# EAGLE design MotorBoard (EAGLE 5.11)
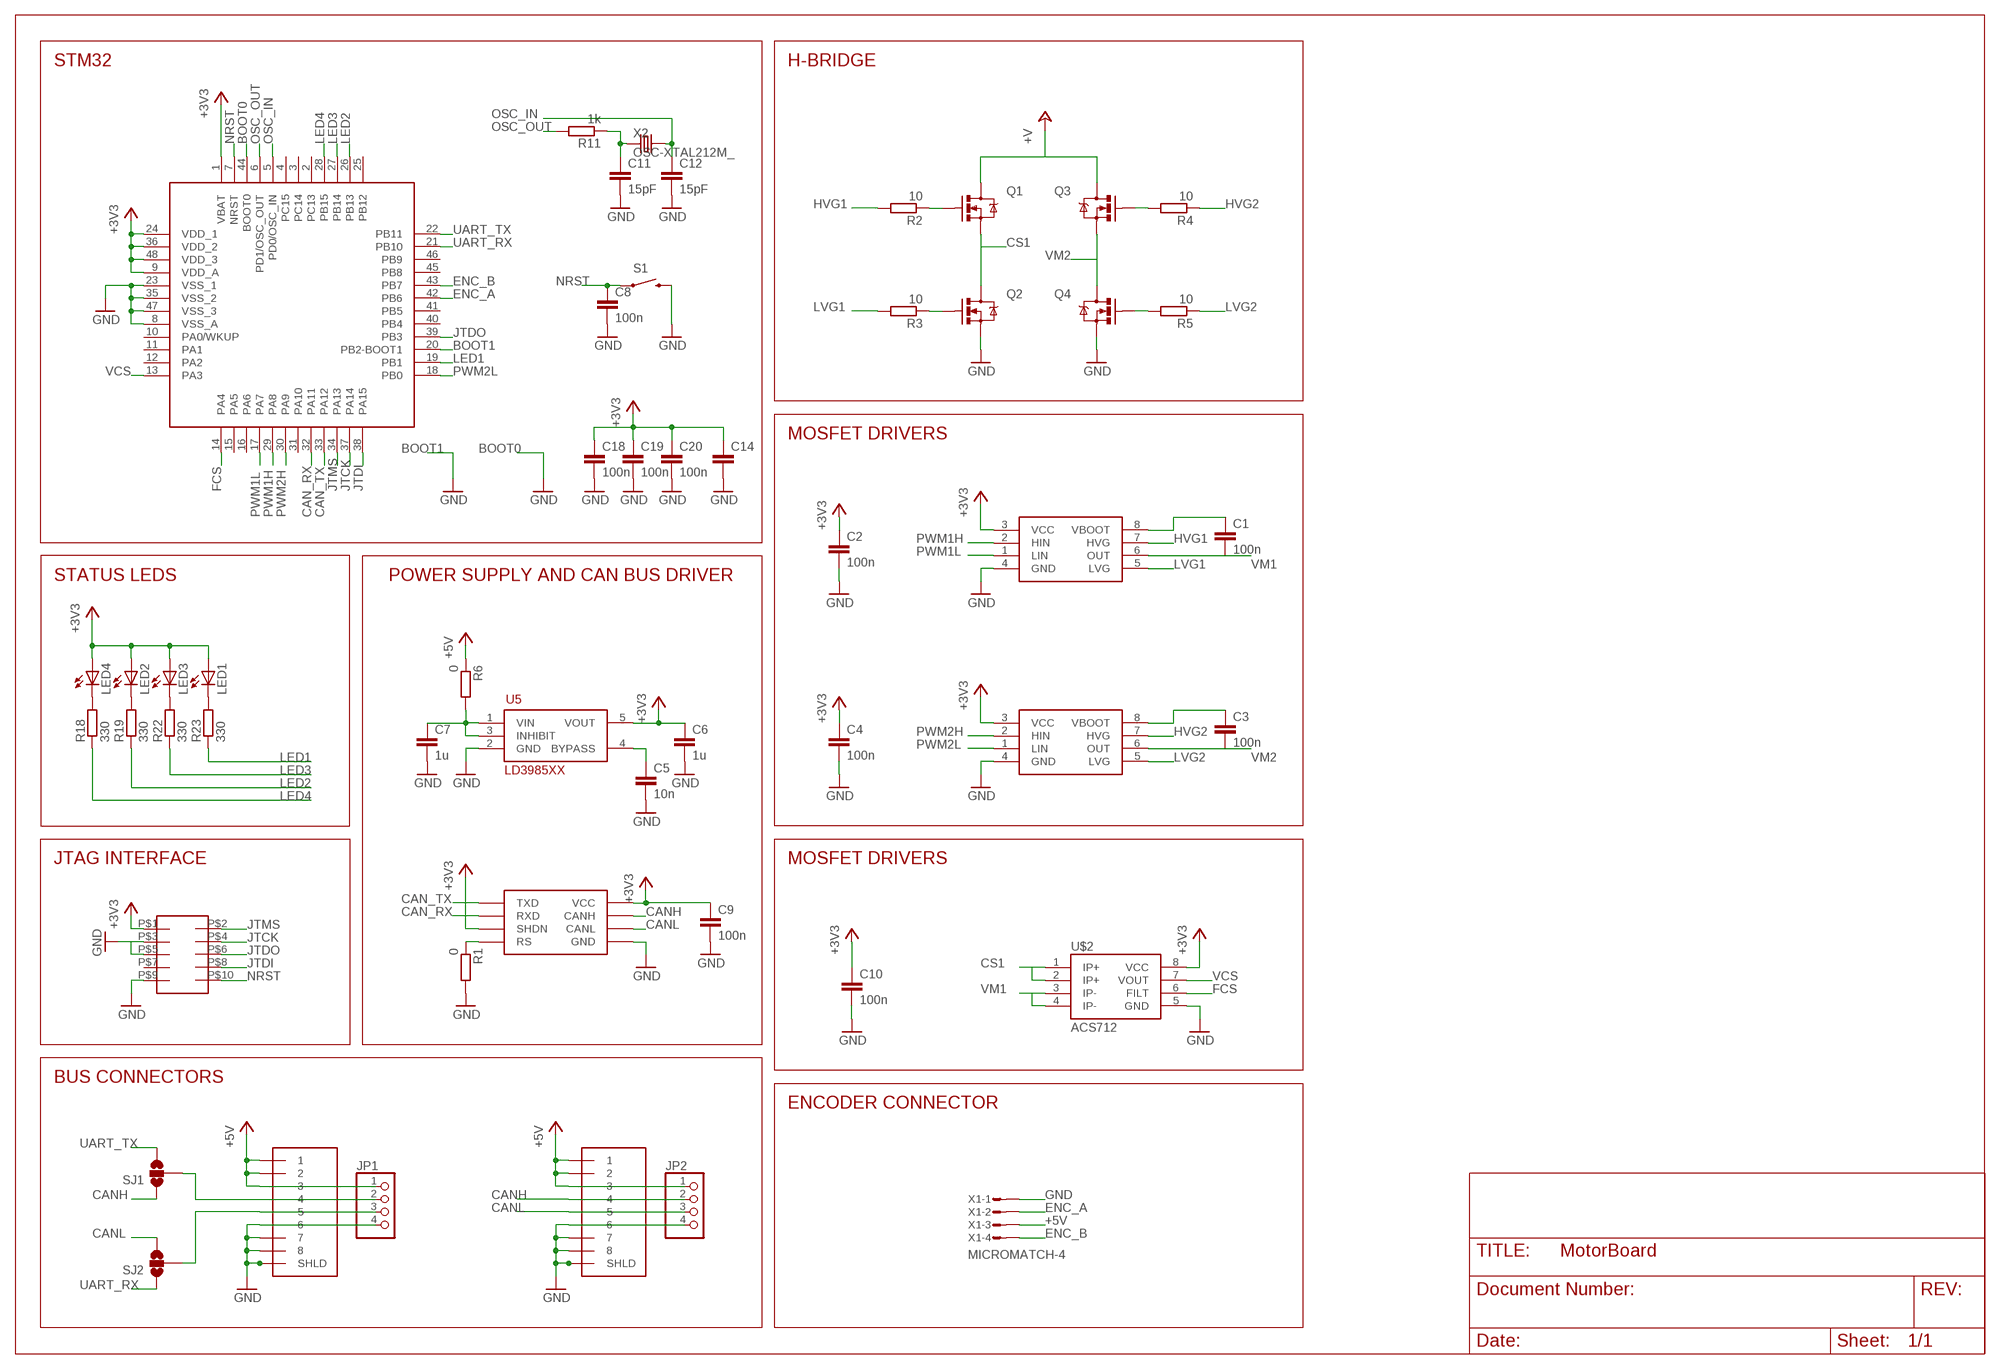
[diagram p0: schematic, sheet 1]

## Parts
1  RJ45-43860  [0438600010]
2  RJ45-43860  [0438600010]
C1  100n  C-EUC0603  [C0603]
C2  100n  C-EUC0603  [C0603]
C3  100n  C-EUC0603  [C0603]
C4  100n  C-EUC0603  [C0603]
C5  10n  C-EUC0603  [C0603]
C6  1u  C-EUC0603  [C0603]
C7  1u  C-EUC0603  [C0603]
C8  100n  C-EUC0603  [C0603]
C9  100n  C-EUC0603  [C0603]
C10  100n  C-EUC0603  [C0603]
C11  15pF  C-EUC0603  [C0603]
C12  15pF  C-EUC0603  [C0603]
C14  C-EUC0805  [C0805]
C18  100n  C-EUC0603  [C0603]
C19  100n  C-EUC0603  [C0603]
C20  100n  C-EUC0603  [C0603]
JP1  PINHD-1X4/90  [1X04/90]
JP2  PINHD-1X4/90  [1X04/90]
LED1  LEDCHIPLED_0805  [CHIPLED_0805]
LED2  LEDCHIPLED_0805  [CHIPLED_0805]
LED3  LEDCHIPLED_0805  [CHIPLED_0805]
LED4  LEDCHIPLED_0805  [CHIPLED_0805]
Q1  MOSFET-NCHANNELFDD8580  [DPAK]
Q2  MOSFET-NCHANNELFDD8580  [DPAK]
Q3  MOSFET-NCHANNELFDD8580  [DPAK]
Q4  MOSFET-NCHANNELFDD8580  [DPAK]
R1  0  R-EU_R0603  [R0603]
R2  10  R-EU_R0603  [R0603]
R3  10  R-EU_R0603  [R0603]
R4  10  R-EU_R0603  [R0603]
R5  10  R-EU_R0603  [R0603]
R6  0  R-EU_R0603  [R0603]
R11  1k  R-EU_R0603  [R0603]
R18  330  R-EU_R0603  [R0603]
R19  330  R-EU_R0603  [R0603]
R22  330  R-EU_R0603  [R0603]
R23  330  R-EU_R0603  [R0603]
S1  SWITCH-MOMENTARY-2-SMD-1101NE  [TACTILE-SWITCH-1101NE]
SJ1  SOLDERJUMPER_2WAYPASTE1&2  [SJ_3_PASTE1&2]
SJ2  SOLDERJUMPER_2WAYPASTE1&2  [SJ_3_PASTE1&2]
SOT1  MAX3051  [SOT23-8L]
U1  STM32F103CX  [LQFP48]
U5  LD3985XX  [SOT23-5L]
U$1  L6387E  [SO8]
U$2  ACS712  [SO08]
U$3  L6387E  [SO8]
U$4  FTSH-105  [FTSH-105]
X1  MICROMATCH-4  [MICROMATCH-4]
X2  OSC-XTAL212M_  [4X6]

## Nets
+3V3: C2.1 C4.1 C6.1 C9.1 C10.1 C14.1 C18.1 C19.1 C20.1 LED1.A LED2.A LED3.A LED4.A SOT1.P$3(VCC) SOT1.P$5(SHDN) U1.1(VBAT) U1.9(VDD_A) U1.24(VDD_1) U1.36(VDD_2) U1.48(VDD_3) U5.5(VOUT) U$1.3(VCC) U$2.8(VCC) U$3.3(VCC) U$4.P$1
+5V: 1.P$1 1.P$2 1.P$3 2.P$1 2.P$2 2.P$3 JP1.1 JP2.1 R6.1 X1.3
+V: Q1.4(D) Q3.4(D)
BOOT0: U1.44(BOOT0) ; supply symbol labelled GND
BOOT1: U1.20(PB2-BOOT1) ; supply symbol labelled GND
CAN_RX: SOT1.P$4(RXD) U1.32(PA11)
CAN_TX: SOT1.P$1(TXD) U1.33(PA12)
CANH: 2.P$4 JP2.2 SJ1.1 SOT1.P$7(CANH)
CANL: 2.P$5 JP2.3 SJ2.3 SOT1.P$6(CANL)
CS1: Q1.3(S) Q2.4(D) U$2.1(IP+) U$2.2(IP+)
ENC_A: U1.42(PB6) X1.2
ENC_B: U1.43(PB7) X1.4
FCS: U1.14(PA4) U$2.6(FILT)
GND: 1.P$6 1.P$7 1.P$8 1.P$9(SHLD) 1.P$10 2.P$6 2.P$7 2.P$8 2.P$9(SHLD) 2.P$10 C2.2 C4.2 C5.2 C6.2 C7.2 C8.2 C9.2 C10.2 C11.2 C12.2 C14.2 C18.2 C19.2 C20.2 JP1.4 JP2.4 Q2.3(S) Q4.3(S) R1.2 S1.P$2 SOT1.P$2(GND) U1.8(VSS_A) U1.23(VSS_1) U1.35(VSS_2) U1.47(VSS_3) U5.2(GND) U$1.4(GND) U$2.5(GND) U$3.4(GND) U$4.P$3 U$4.P$9 X1.1
HVG1: R2.2 U$1.7(HVG)
HVG2: R4.1 U$3.7(HVG)
JTCK: U1.37(PA14) U$4.P$4
JTDI: U1.38(PA15) U$4.P$8
JTDO: U1.39(PB3) U$4.P$6
JTMS: U1.34(PA13) U$4.P$2
LED1: R23.1 U1.19(PB1)
LED2: R19.1 U1.26(PB13)
LED3: R22.1 U1.27(PB14)
LED4: R18.1 U1.28(PB15)
LVG1: R3.2 U$1.5(LVG)
LVG2: R5.1 U$3.5(LVG)
N$1: U$4.P$5
N$2: R1.1 SOT1.P$8(RS)
N$3: 1.P$4 JP1.2 SJ1.2
N$4: C5.1 U5.4(BYPASS)
N$5: Q1.1(G) R2.1
N$6: Q2.1(G) R3.1
N$7: Q3.1(G) R4.2
N$8: 1.P$5 JP1.3 SJ2.2
N$9: Q4.1(G) R5.2
N$10: C7.1 R6.2 U5.1(VIN) U5.3(INHIBIT)
N$12: C11.1 R11.1 X2.1(X1)
N$15: LED4.C R18.2
N$16: C3.1 U$3.8(VBOOT)
N$18: LED2.C R19.2
N$20: LED3.C R22.2
N$22: LED1.C R23.2
N$26: C1.1 U$1.8(VBOOT)
NRST: C8.1 S1.P$1 U1.7(NRST) U$4.P$10
OSC_IN: C12.1 U1.5(PD0/OSC_IN) X2.2(X2)
OSC_OUT: R11.2 U1.6(PD1/OSC_OUT)
PWM1H: U1.29(PA8) U$1.2(HIN)
PWM1L: U1.17(PA7) U$1.1(LIN)
PWM2H: U1.30(PA9) U$3.2(HIN)
PWM2L: U1.18(PB0) U$3.1(LIN)
UART_RX: SJ2.1 U1.21(PB10)
UART_TX: SJ1.3 U1.22(PB11)
VCS: U1.13(PA3) U$2.7(VOUT)
VM1: C1.2 U$1.6(OUT) U$2.3(IP-) U$2.4(IP-)
VM2: C3.2 Q3.3(S) Q4.4(D) U$3.6(OUT)
Unconnected: U1.2(PC13) U1.3(PC14) U1.4(PC15) U1.10(PA0/WKUP) U1.11(PA1) U1.12(PA2) U1.15(PA5) U1.16(PA6) U1.25(PB12) U1.31(PA10) U1.40(PB4) U1.41(PB5) U1.45(PB8) U1.46(PB9) U$4.P$7

## Notes on the sheet
- STM32 | H-BRIDGE
- MOSFET DRIVERS
- STATUS LEDS | POWER SUPPLY AND CAN BUS DRIVER
- JTAG INTERFACE | MOSFET DRIVERS
- BUS CONNECTORS
- ENCODER CONNECTOR

## Library data of the parts
1 2 = molex:RJ45-43860
C1-C12 C14 C18-C20 = rcl:C-EU: CAPACITOR, European symbol
JP1 JP2 = pinhead:PINHD-1X4: PIN HEADER
LED1-LED4 = led:LED: LED OSRAM: - CHIPLED LG R971, LG N971, LY N971, LG Q971, LY Q971, LO R971, LY R971 LH N974, LH R974 LS Q976, LO Q976, LY Q976 LO Q996 - Hyper CHIPLED LW Q18S LB Q993, LB Q99A, LB R99A - SideLED LS A670, LO A670, LY A670, LG A670, LP A670 LB A673, LV A673, LT A673, LW A673 LH A674 LY A675 LS A676, LA A676, LO A676, LY A676, LW A676 LS A679, LY A679, LG A679 - Hyper Micro SIDELED® LS Y876, LA Y876, LO Y876, LY Y876 LT Y87S - SmartLED LW L88C, LW L88S LB L89C, LB L89S, LG L890 LS L89K, LO L89K, LY L89K LS L896, LA L896, LO L896, LY L896 - TOPLED LS T670, LO T670, LY T670, LG T670, LP T670 LSG T670, LSP T670, LSY T670, LOP T670, LYG T670 LG T671, LOG T671, LSG T671 LB T673, LV T673, LT T673, LW T673 LH T674 LS T676, LA T676, LO T676, LY T676, LB T676, LH T676, LSB T676, LW T676 LB T67C, LV T67C, LT T67C, LS T67K, LO T67K, LY T67K, LW E67C LS E67B, LA E67B, LO E67B, LY E67B, LB E67C, LV E67C, LT E67C LW T67C LS T679, LY T679, LG T679 LS T770, LO T770, LY T770, LG T770, LP T770 LB T773, LV T773, LT T773, LW T773 LH T774 LS E675, LA E675, LY E675, LS T675 LS T776, LA T776, LO T776, LY T776, LB T776 LHGB T686 LT T68C, LB T68C - Hyper Mini TOPLED® LB M676 - Mini TOPLED Santana® LG M470 LS M47K, LO M47K, LY M47K Source: http://www.osram.convergy.de LUXEON: - LUMILED® LXK2-PW12-R00, LXK2-PW12-S00, LXK2-PW14-U00, LXK2-PW14-V00 LXK2-PM12-R00, LXK2-PM12-S00, LXK2-PM14-U00 LXK2-PE12-Q00, LXK2-PE12-R00, LXK2-PE12-S00, LXK2-PE14-T00, LXK2-PE14-U00 LXK2-PB12-K00, LXK2-PB12-L00, LXK2-PB12-M00, LXK2-PB14-N00, LXK2-PB14-P00, LXK2-PB14-Q00 LXK2-PR12-L00, LXK2-PR12-M00, LXK2-PR14-Q00, LXK2-PR14-R00 LXK2-PD12-Q00, LXK2-PD12-R00, LXK2-PD12-S00 LXK2-PH12-R00, LXK2-PH12-S00 LXK2-PL12-P00, LXK2-PL12-Q00, LXK2-PL12-R00 Source: www.luxeon.com KINGBRIGHT: KA-3528ASYC Source: www.kingbright.com
Q1-Q4 = SparkFun:MOSFET-NCHANNEL
R1-R6 R11 R18 R19 R22 R23 = rcl:R-EU_: RESISTOR, European symbol
S1 = SparkFun:SWITCH-MOMENTARY-2
SJ1 SJ2 = SparkFun:SOLDERJUMPER_2WAY: Solder Jumper 2 way solder jumper
SOT1 = maxim:MAX3051
U1 = st:STM32F103CX
U5 = st:LD3985XX
U$1 U$3 = st:L6387E
U$2 = SparkFun:ACS712
U$4 = samtec:FTSH-105
X1 = apbteam_con-amp-micromatch:MICROMATCH-4: MicroMaTch 4
X2 = dp_devices:OSC-XTAL2

## Board
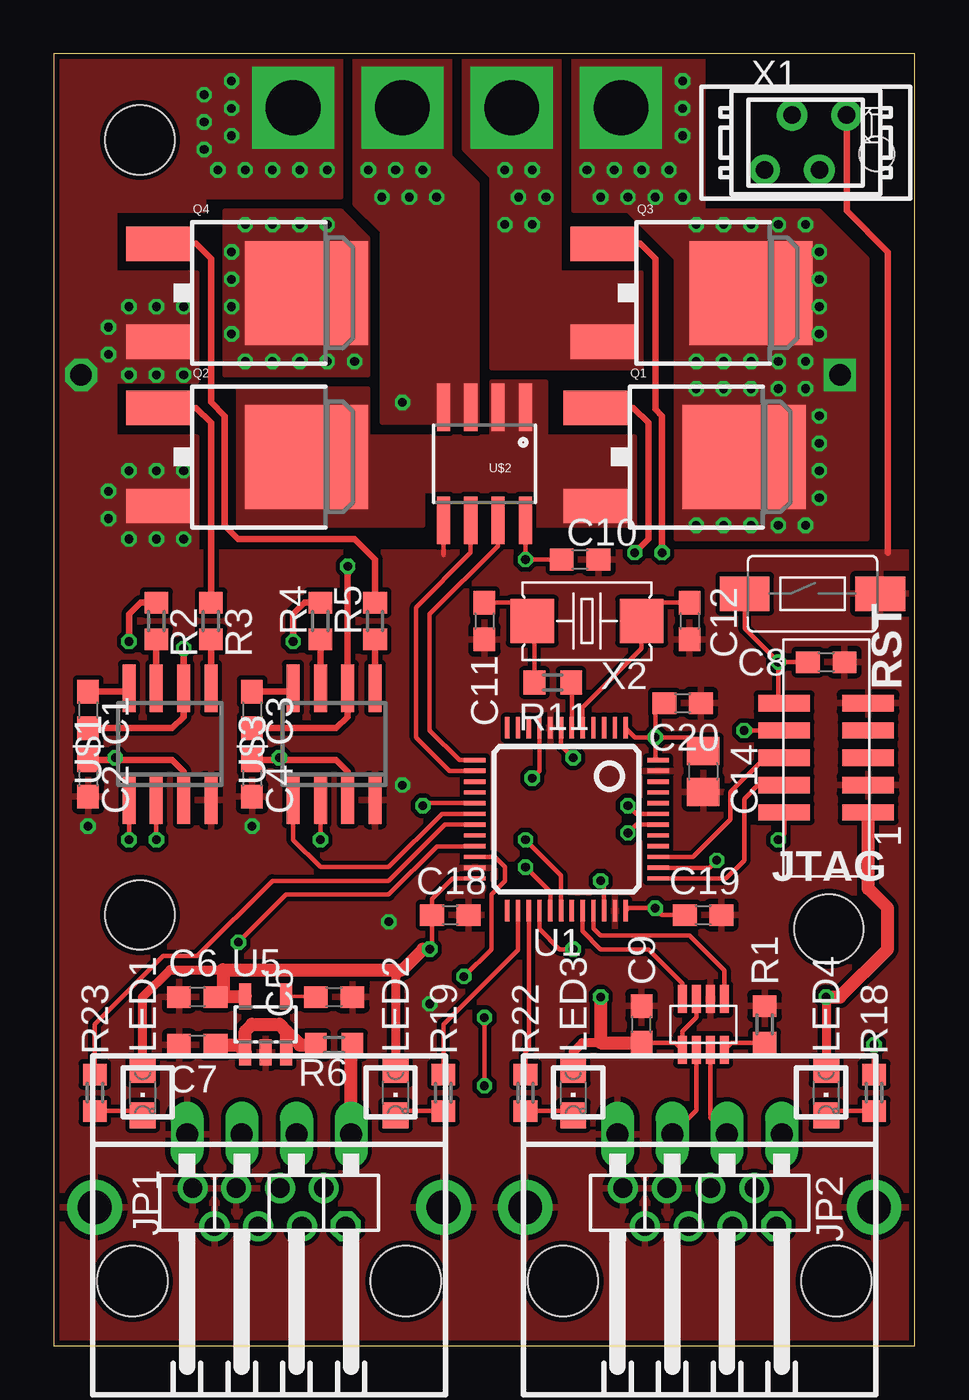
[diagram p1: board, top side]
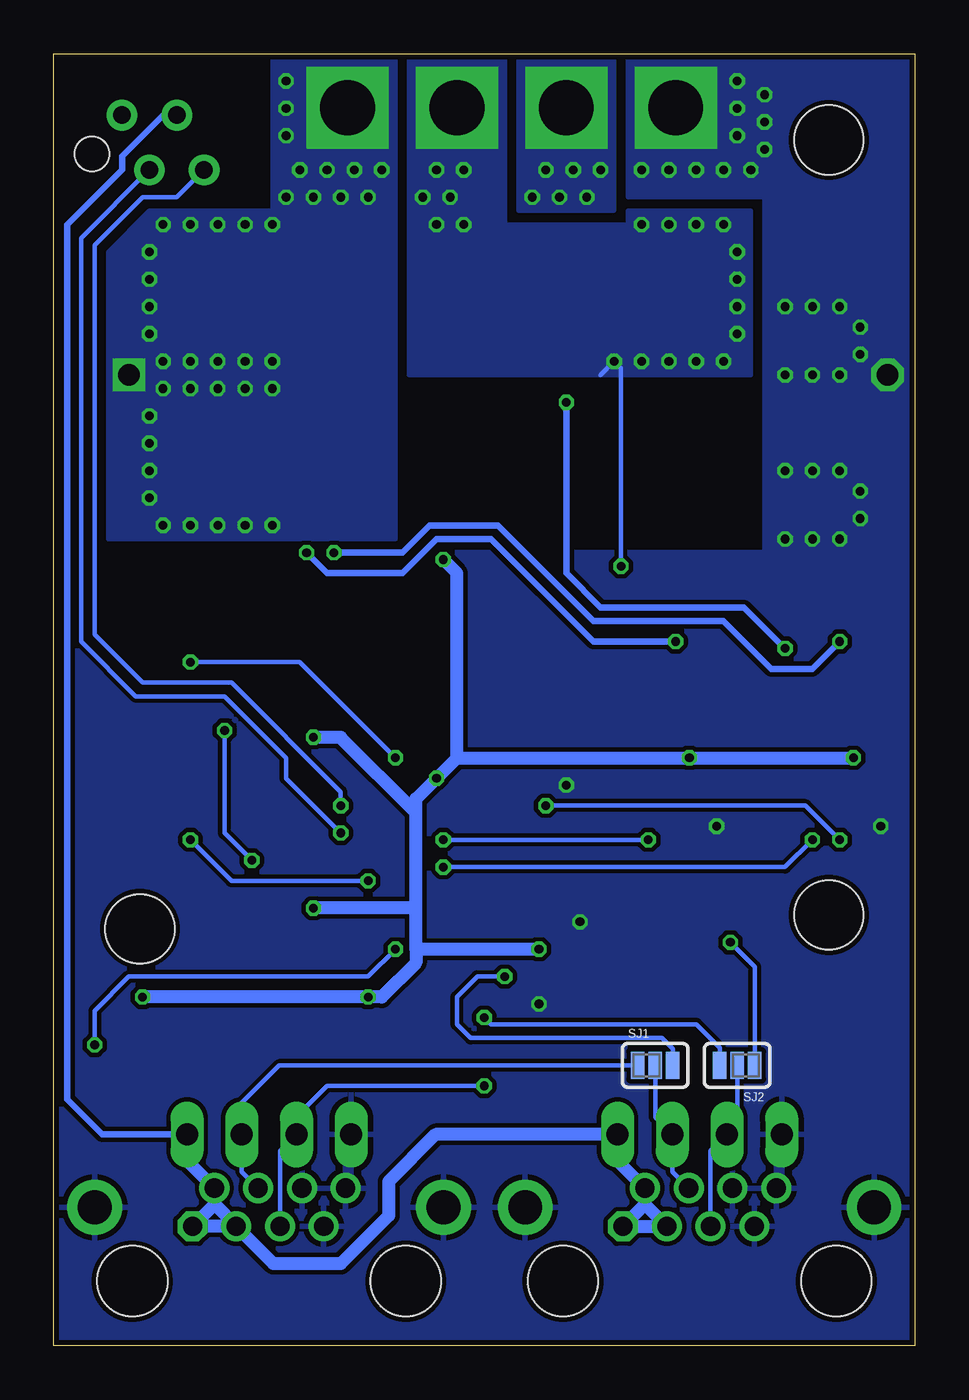
[diagram p2: board, bottom side, seen from below]

Size 40 x 60 mm. Coordinates in mm from the lower left corner, seen from the top.
Outline: 0,0 40,0 40,60 0,60 0,0
Copper layers (1*16): Top 0.035mm / dielectric 1.5mm / Bottom 0.035mm
Design rules "ITead_rule *": minimum track width 6mil, minimum drill 12mil, track to track 8mil, track to pad 8mil, pad to pad 8mil, via to via 8mil, smd to smd 0mil, copper to edge 10mil, drill to drill 10mil, minimum pad ring 10mil, minimum via ring 6mil, stop-mask expansion 2mil, vias tented up to drill 100mil, thermal gap 10mil
Holes 3.2 mm at 4,20 36,19.36 4,56

### Footprints (pad centres in the part's own frame; a part is rotated, then mirrored left to right if it is on the bottom)
0438600010 = drill 0.889 octagon: P$1 3.556,2.54 | drill 0.889 round: P$2 2.54,4.318; P$3 1.524,2.54; P$4 0.508,4.318; P$5 -0.508,2.54; P$6 -1.524,4.318; P$7 -2.54,2.54; P$8 -3.556,4.318 | drill 1.575 pad 2.54 round: P$9 8.103,3.429; P$10 -8.103,3.429 | hole 3.251: -6.35,0; 6.35,0
C0603 = smd 1.1 x 1: 1 -0.85,0; 2 0.85,0
C0805 = smd 1.3 x 1.5: 1 -0.95,0; 2 0.95,0
1X04/90 = drill 1.016 long: 1 -3.81,-3.81; 2 -1.27,-3.81; 3 1.27,-3.81; 4 3.81,-3.81
CHIPLED_0805 = smd 1.2 x 1.2: A 0,-1.05; C 0,1.05
DPAK = smd 1.6 x 3: 1 -2.28,-5.31; 3 2.28,-5.31 | smd 4.826 x 5.715: 4 0,1.588
R0603 = smd 1 x 1.1: 1 -0.85,0; 2 0.85,0
TACTILE-SWITCH-1101NE = smd 2.3 x 1.6: P$1 -3.15,0; P$2 3.15,0
SJ_3_PASTE1&2 = smd 0.635 x 1.27: 1 -0.813,0; 2 0,0; 3 0.813,0
SOT23-8L@1 = smd 1.3 x 0.42: P$1 -1.175,1.3; P$2 -1.175,0.65; P$3 -1.175,0; P$4 -1.175,-0.65; P$5 1.175,-0.65; P$6 1.175,0; P$7 1.175,0.65; P$8 1.175,1.3
LQFP48 = smd 1 x 0.2: 1 -4.25,2.75; 2 -4.25,2.25; 3 -4.25,1.75; 4 -4.25,1.25; 5 -4.25,0.75; 6 -4.25,0.25; 7 -4.25,-0.25; 8 -4.25,-0.75; 9 -4.25,-1.25; 10 -4.25,-1.75; 11 -4.25,-2.25; 12 -4.25,-2.75; 25 4.25,-2.75; 26 4.25,-2.25; 27 4.25,-1.75; 28 4.25,-1.25; 29 4.25,-0.75; 30 4.25,-0.25; 31 4.25,0.25; 32 4.25,0.75; 33 4.25,1.25; 34 4.25,1.75; 35 4.25,2.25; 36 4.25,2.75 | smd 0.2 x 1: 13 -2.75,-4.25; 14 -2.25,-4.25; 15 -1.75,-4.25; 16 -1.25,-4.25; 17 -0.75,-4.25; 18 -0.25,-4.25; 19 0.25,-4.25; 20 0.75,-4.25; 21 1.25,-4.25; 22 1.75,-4.25; 23 2.25,-4.25; 24 2.75,-4.25; 37 2.75,4.25; 38 2.25,4.25; 39 1.75,4.25; 40 1.25,4.25; 41 0.75,4.25; 42 0.25,4.25; 43 -0.25,4.25; 44 -0.75,4.25; 45 -1.25,4.25; 46 -1.75,4.25; 47 -2.25,4.25; 48 -2.75,4.25
SOT23-5L = smd 0.55 x 1.2: 1 -0.95,-1.3; 2 0,-1.3; 3 0.95,-1.3; 4 0.95,1.3; 5 -0.95,1.3
SO8 = smd 0.6 x 2.2: 1 -1.905,-2.6; 2 -0.635,-2.6; 3 0.635,-2.6; 4 1.905,-2.6; 5 1.905,2.6; 6 0.635,2.6; 7 -0.635,2.6; 8 -1.905,2.6
SO08 = smd 0.61 x 2.21: 1 -1.905,-2.616; 2 -0.635,-2.616; 3 0.635,-2.616; 4 1.905,-2.616; 5 1.905,2.616; 6 0.635,2.616; 7 -0.635,2.616; 8 -1.905,2.616
FTSH-105 = smd 0.76 x 2.4: P$1 -2.54,-1.95; P$2 -2.54,1.95; P$3 -1.27,-1.95; P$4 -1.27,1.95; P$5 0,-1.95; P$6 0,1.95; P$7 1.27,-1.95; P$8 1.27,1.95; P$9 2.54,-1.95; P$10 2.54,1.95
MICROMATCH-4 = drill 0.813 pad 1.422 round: 1 1.905,1.27; 2 0.635,-1.27; 3 -0.635,1.27; 4 -1.905,-1.27 | hole 1.6: 3.305,-0.53
4X6 = smd 2.032 x 2.032: 1 -2.54,0; 2 2.54,0

### Placement (x,y rotation side)
1  10,3 0 top
2  30,3 0 top
C1  1.59,29.53 270 top
C2  1.59,26.35 270 top
C3  9.21,29.53 270 top
C4  9.21,26.35 270 top
C5  13.02,16.19 0 top
C6  6.67,16.19 180 top
C7  6.67,13.97 180 top
C8  35.88,31.75 0 top
C9  27.3,14.92 90 top
C10  24.45,36.51 0 top
C11  20,33.66 270 top
C12  29.53,33.66 270 top
C14  30.16,26.67 270 top
C18  18.41,20 0 top
C19  30.16,20 0 top
C20  29.21,29.84 0 top
JP1  10,6 180 top
JP2  30,6 180 top
LED1  4.13,11.75 180 top
LED2  15.88,11.75 180 top
LED3  24.13,11.75 180 top
LED4  35.88,11.75 180 top
Q1  30.48,41.27 270 top
Q2  10.16,41.27 270 top
Q3  30.8,48.9 270 top
Q4  10.16,48.9 270 top
R1  33.02,14.92 90 top
R2  4.76,33.66 270 top
R3  7.3,33.66 270 top
R4  12.38,33.66 90 top
R5  14.92,33.66 90 top
R6  13.02,13.97 180 top
R11  23.18,30.8 0 top
R18  38.1,11.75 270 top
R19  18.1,11.75 270 top
R22  21.91,11.75 270 top
R23  1.91,11.75 270 top
S1  35.24,34.92 0 top
SJ1  12.06,13.02 0 bottom
SJ2  8.26,13.02 180 bottom
SOT1  MAX3051  [SOT23-8L@1]  29.84,14.92 270 top
U1  23.81,24.45 270 top
U5  9.84,14.92 0 top
U$1  5.4,27.94 0 top
U$2  20,40.96 180 top
U$3  13.02,27.94 0 top
U$4  35.88,27.3 90 top
X1  34.92,55.88 0 top
X2  24.77,33.66 0 top

### Tracks (layer width: path | path; a pad name or v marks a point on that pad's centre or on a via)
+3V3  (via drill 0.4)
  Top 0.203: U1.36 26.68,20.32 v27.94,20.32 28.26,20 C19.1 | C9.1 28.87,14.07 SOT1.P$5 29.2,14.59 29.84,15.24 SOT1.P$3 | U1.48 27.94,27.32 v27.94,28.26 | U1.1 27,28.26 v27.94,28.26 | LED4.A 35.88,13.97 | U1.9 22.56,26.69 v22.23,26.35 | v2.86,27.3 2.86,27.2 | v10.48,27.3 10.48,27.2 | C14.1 29.52,28.26 v27.94,28.26 | v27.94,28.26 27.94,29.43 C20.1 | U1.24 18.52,21.7 17.57,20.74 C18.1 17.57,18.52 v17.46,18.41 | U$2.8 v21.91,36.51 C10.1
  Top 0.254: 7.87,16.22 C6.1
  Top 0.305: C2.1 2.86,27.2 5.5,27.2 6.03,26.67 U$1.3 | C4.1 10.48,27.2 13.12,27.2 13.65,26.67 U$3.3
  Top 0.406: LED1.A 4.13,16.19 5.4,17.46 7.87,17.46 | LED2.A 15.88,17.14 16.19,17.46 | 25.4,14.07 24.55,14.07 24.13,13.65 LED3.A | v35.88,16.19 LED4.A
  Top 0.61: U5.5 7.87,16.22 7.87,17.46 16.19,17.46 17.14,18.41 v17.46,18.41 | C9.1 25.4,14.07 v25.4,16.19 | U$4.P$1 37.83,21.23 38.73,20.32 38.73,18.41 36.51,16.19 v35.88,16.19
  Bottom 0.61: v17.46,18.41 23.18,18.41 | v35.88,16.19 v25.4,16.19 24.77,16.19 23.18,17.78 23.18,18.41 | 23.18,24.77 23.18,25.4 v22.23,26.35 21.27,27.3 | 23.18,18.41 23.18,20.32 | 23.18,20.32 23.18,24.77 | 21.27,27.3 v10.48,27.3 v2.86,27.3 | v21.91,36.51 21.27,35.88 21.27,27.3 | v27.94,28.26 26.67,28.26 23.18,24.77 | 23.18,20.32 v27.94,20.32
+5V
  Top 0.61: JP1.1 13.81,13.91 R6.1
  Bottom 0.305: X1.3 34.92,57.15 36.83,55.24 36.83,54.61 39.37,52.07 39.37,11.43 37.75,9.81 JP2.1
  Bottom 0.61: 12.54,6.56 1.P$1 11.57,5.54 | 12.54,6.56 1.P$2 13.81,8.59 JP1.1 22.26,9.81 24.45,7.62 24.45,6.03 26.67,3.81 29.79,3.81 2.P$3 | 12.54,6.56 1.P$3 | 2.P$3 32.54,6.56 | 2.P$3 2.P$1 32.54,6.56 | 32.54,6.56 2.P$2 33.81,8.59 JP2.1
+V  (via drill 0.4, 1, 2.54 pad 3.81)
  other vias: 26.35,57.5 35.56,50.8 35.56,49.53 35.56,48.26 35.56,46.99 34.92,45.72 33.66,45.72 32.38,45.72 31.11,45.72 29.84,45.72 29.84,52.07 31.11,52.07 32.38,52.07 33.66,52.07 34.92,52.07 29.84,44.45 31.11,44.45 32.38,44.45 33.66,44.45 34.92,44.45 35.56,43.18 35.56,41.91 35.56,40.64 35.56,39.37 34.92,38.1 33.66,38.1 32.38,38.1 31.11,38.1 29.84,38.1 24.77,54.61 26.04,54.61 27.3,54.61 29.21,58.74 29.21,57.47 29.21,56.2 26.67,53.34 27.94,53.34 25.4,53.34 28.57,54.61 29.21,53.34 36.51,45.09
  pour Top (no thermals): 24.13,60.01 30.16,60.01 30.16,52.7 35.56,52.7 37.78,50.48 37.78,37.47 28.89,37.47 28.89,50.48 26.67,52.7 24.13,52.7
  pour Bottom (no thermals): 24.13,60.01 24.13,37.47 37.47,37.47 37.47,50.8 35.56,52.7 29.84,52.7 29.84,60.01
CAN_RX
  Top 0.203: 29.21,16.11 29.21,16.83 27.62,18.41 25.4,18.41 24.56,19.25 U1.32
  Top 0.254: 29.21,16.11 SOT1.P$4
CAN_TX
  Top 0.203: SOT1.P$1 31.14,17.43 29.53,19.05 25.4,19.05 25.06,19.39 U1.33
CANH
  Top 0.203: SOT1.P$7 30.5,10.59 JP2.2
  Bottom 0.203: 2.P$4 31.27,8.08 JP2.2 31.27,11.28 29.53,13.02 SJ1.1
CANL  (via drill 0.4)
  Top 0.203: SOT1.P$6 29.84,10.93 JP2.3 | v20,15.24 v20,12.06
  Bottom 0.203: 2.P$5 29.49,9.05 JP2.3 28.73,10.64 27.3,12.06 v20,12.06 | v20,15.24 19.68,14.92 10.16,14.92 9.07,13.83 SJ2.3
CS1
  pour Top (no thermals): 8.57,38.1 17.14,38.1 17.14,39.69 22.23,39.69 22.23,38.1 26.99,38.1 26.99,42.23 22.86,42.23 22.86,44.77 20.32,44.77 20.32,42.23 14.61,42.23 14.61,44.45 8.57,44.45
ENC_A  (via drill 0.4)
  Top 0.203: U1.42 27.05,24.2 v26.67,23.81
  Bottom 0.203: X1.2 38.73,51.44 38.73,32.7 36.2,30.16 32.07,30.16 29.21,27.3 29.21,26.35 v26.67,23.81
ENC_B  (via drill 0.4)
  Top 0.203: U1.43 27.05,24.7 v26.67,25.08
  Bottom 0.203: X1.4 34.29,53.34 35.88,53.34 38.1,51.12 38.1,33.02 35.88,30.8 31.75,30.8 26.67,25.72 v26.67,25.08
FCS
  Top 0.203: U$2.6 19.37,36.83 16.83,34.29 16.83,28.26 18.39,26.7 U1.14
GND  (via drill 0.4, 1, 2.54 pad 3.81)
  Top 0.203: 18.1,36.73 U$2.5
  Top 0.305: X1.1 36.83,52.7 38.73,50.8 38.73,36.83
  other vias: 11.11,57.5 6.03,45.09 4.76,45.09 3.49,45.09 2.54,46.04 2.54,47.31 3.49,48.26 4.76,48.26 6.03,48.26 6.03,40.64 4.76,40.64 3.49,40.64 2.54,39.69 2.54,38.42 3.49,37.47 4.76,37.47 6.03,37.47 12.7,54.61 11.43,54.61 10.16,54.61 8.89,54.61 8.26,57.47 8.26,58.74 8.26,56.2 6.99,58.1 6.99,56.83 6.99,55.56 7.62,54.61 1.59,24.13 9.21,24.13 16.19,26.04 17.46,15.88 15.56,19.68 1.27,45.09
  pour Top: 0,0 40,0 40,36.83 0,36.83
  pour Bottom: 0,0 40.01,0 40.01,36.83 0,36.83
  pour Top (no thermals): 13.34,60.01 0,60.01 0,36.83 6.67,36.83 6.67,42.23 2.86,42.23 2.86,44.77 6.67,44.77 6.67,49.85 2.86,49.85 2.86,52.7 6.99,52.7 6.99,53.34 13.34,53.34
  pour Bottom (no thermals): 13.34,60.01 13.34,53.34 6.99,53.34 6.99,36.2 0,36.2 0,60.01
HVG1
  Top 0.305: R2.2 U$1.7
HVG2
  Top 0.305: R4.1 U$3.7
JTCK
  Top 0.203: 32.7,26.04 32.07,25.4 32.07,22.54 31.22,21.7 U1.37
  Top 0.254: 32.7,26.04 U$4.P$4
JTDI  (via drill 0.4)
  Top 0.203: U1.38 30.45,22.2 v30.8,22.54 | v32.07,28.57 U$4.P$8
  Bottom 0.203: v30.8,22.54 32.07,23.81 v32.07,28.57
JTDO
  Top 0.203: 33.02,27.3 31.43,25.72 31.43,24.45 29.68,22.7 U1.39
  Top 0.254: 33.02,27.3 U$4.P$6
JTMS  (via drill 0.4)
  Top 0.203: U$4.P$2 33.93,23.77 v33.66,23.5 | U1.34 25.56,21.43 v25.4,21.59
  Bottom 0.203: v25.4,21.59 31.75,21.59 v33.66,23.5
LED1
  Top 0.203: U1.19 18.16,24.2 15.56,21.59 10.16,21.59 6.67,18.1 5.08,18.1 1.91,14.92 R23.1
LED2
  Top 0.203: U1.26 21.56,18.39 18.1,14.92 R19.1
LED3
  Top 0.203: U1.27 22.06,13.81 21.91,13.65 R22.1
LED4  (via drill 0.4)
  Top 0.203: v38.1,13.97 R18.1 | U1.28 22.56,19.35 23.5,18.41 v24.13,18.41
  Bottom 0.203: v24.13,18.41 25.4,17.14 36.51,17.14 38.1,15.56 v38.1,13.97
LVG1
  Top 0.305: R3.2 U$1.5
LVG2
  Top 0.305: R5.1 U$3.5
N$2
  Top 0.203: R1.1 31.47,14.07 SOT1.P$8
N$3
  Bottom 0.203: SJ1.2 12.06,10.61 JP1.2 11.27,8.08 1.P$4
N$4
  Top 0.152: U5.4 12.14,16.22 C5.1
N$5  (via drill 0.4)
  Top 0.305: Q1.1 26.93,43.55 27.62,42.86 27.62,37.47 v26.99,36.83 | R2.1 4.03,34.51 3.49,33.97 v3.49,32.7
  Bottom 0.305: v3.49,32.7 4.76,31.43 6.67,31.43 8.89,33.66 14.92,33.66 19.37,38.1 22.54,38.1 23.81,36.83 v26.99,36.83
N$6
  Top 0.305: Q2.1 6.61,43.55 7.3,42.86 R3.1
N$7  (via drill 0.4)
  Top 0.305: Q3.1 27.25,51.17 27.94,50.48 27.94,43.5 28.26,43.18 v28.26,36.83 | R4.2 11.64,34.51 11.11,33.97 v11.11,32.7
  Bottom 0.305: v11.11,32.7 14.92,32.7 19.68,37.47 22.23,37.47 23.81,35.88 27.3,35.88 v28.26,36.83
N$8
  Bottom 0.203: SJ2.2 8.26,10.29 JP1.3 9.49,9.05 1.P$5
N$9
  Top 0.305: Q4.1 6.61,51.17 7.3,50.48 7.3,43.81 7.94,43.18 7.94,38.1 8.57,37.47 13.97,37.47 14.92,36.51 R5.2
N$10
  Top 0.61: 10.79,14.61 U5.3 | 10.79,14.61 10.48,14.92 9.21,14.92 8.89,14.61 U5.1 8.54,13.97 C7.1 | R6.2 11.43,13.97 10.79,14.61
N$12
  Top 0.203: C11.1 21.38,34.51 X2.1 22.33,33.55 R11.1
N$15
  Top 0.203: R18.2 36.08,10.9 LED4.C
N$16
  Top 0.203: 10.95,30.38 U$3.8
  Top 0.305: C3.1 10.95,30.38
N$18
  Top 0.203: R19.2 16.07,10.9 LED2.C
N$20
  Top 0.203: R22.2 23.93,10.9 LED3.C
N$22
  Top 0.203: R23.2 3.93,10.9 LED1.C
N$26
  Top 0.203: 3.33,30.38 U$1.8
  Top 0.305: C1.1 3.33,30.38
NRST  (via drill 0.4)
  Top 0.203: v33.66,31.75 33.66,30.12 U$4.P$10 | v33.66,31.75 C8.1 | S1.P$1 32.09,33.31 v33.66,31.75 | U1.7 23.56,27.87 v24.13,27.3
  Bottom 0.203: v24.13,27.3 28.57,31.75 v33.66,31.75
OSC_IN
  Top 0.203: X2.2 27.09,33.44 | C12.1 28.16,34.51 X2.2 | U1.5 24.56,29.64 27.3,32.38 X2.2
OSC_OUT
  Top 0.203: R11.2 24.06,30.76 U1.6
PWM1H  (via drill 0.4)
  Top 0.203: U$1.2 v4.76,23.5 | U1.29 23.06,21.07 v21.91,22.23
  Bottom 0.203: v21.91,22.23 6.03,22.23 v4.76,23.5
PWM1L  (via drill 0.4)
  Top 0.203: U1.17 17.26,25.2 v17.14,25.08 | U$1.1 v3.49,23.5
  Bottom 0.203: v17.14,25.08 5.08,25.08 v3.49,23.5
PWM2H  (via drill 0.4)
  Top 0.203: U$3.2 v12.38,23.5 | U1.30 23.56,21.84 v21.91,23.5
  Bottom 0.203: v12.38,23.5 v21.91,23.5
PWM2L
  Top 0.203: U$3.1 11.11,23.5 12.38,22.23 15.56,22.23 18.03,24.7 U1.18
UART_RX  (via drill 0.4)
  Top 0.203: U1.21 17.8,23.2 15.56,20.95 10.79,20.95 v8.57,18.73
  Bottom 0.203: SJ2.1 7.44,17.6 v8.57,18.73
UART_TX  (via drill 0.4)
  Top 0.203: U1.22 20.48,22.7 20.95,22.23 20.95,21.59 20.32,20.95 20.32,18.41 v19.05,17.14
  Bottom 0.203: SJ1.3 11.25,13.79 11.75,14.29 20.64,14.29 21.27,14.92 21.27,16.19 20.32,17.14 v19.05,17.14
VCS
  Top 0.203: U$2.7 20.64,37.15 17.46,33.97 17.46,28.57 18.84,27.2 U1.13
VM1  (via drill 0.4, 2.54 pad 3.81)
  Top 0.305: C1.2 5.5,28.68 6.03,29.21 U$1.6 v6.03,32.38
  Bottom 0.305: v6.03,32.38 7.94,34.29 14.61,34.29 16.19,35.88 v16.19,43.81
  other vias: 16.19,57.5 14.61,54.61 15.88,54.61 17.14,54.61 17.78,53.34 16.51,53.34 15.24,53.34
  pour Top (no thermals): 13.97,60.01 18.41,60.01 18.41,55.24 19.68,53.98 19.68,42.86 15.24,42.86 15.24,51.75 13.97,53.02
  pour Bottom: 13.97,60.01 13.97,52.7 18.41,52.7 18.41,60.01
VM2  (via drill 0.4, 2.54 pad 3.81)
  Top 0.305: C3.2 13.12,28.68 13.65,29.21 U$3.6 v13.65,36.2
  Bottom 0.203: 14.61,45.09 v13.97,45.72 13.65,45.4 v13.65,36.2
  other vias: 21.27,57.5 12.7,52.07 11.43,52.07 10.16,52.07 8.89,52.07 8.26,50.8 8.26,49.53 8.26,48.26 8.26,46.99 8.89,45.72 10.16,45.72 11.43,45.72 12.7,45.72 20.95,54.61 22.23,54.61 20.95,52.07 22.23,52.07 22.86,53.34 21.59,53.34
  pour Top (no thermals): 19.05,60.01 23.5,60.01 23.5,52.7 23.5,49.85 27.3,49.85 27.3,45.4 20.32,45.4 20.32,54.29 19.05,55.56
  pour Top (no thermals): 14.61,51.44 13.34,52.7 7.94,52.7 7.94,45.09 14.61,45.09
  pour Bottom (no thermals): 23.5,60.01 23.5,45.09 7.62,45.09 7.62,52.7 13.34,52.7 13.34,52.07 19.05,52.07 19.05,60.01

### Text on the board
_tsilk: RST | 1 | JTAG
_bsilk: UART | CAN | UART | CAN